# EAGLE design homecomputer-6502 (EAGLE 6.5.0)
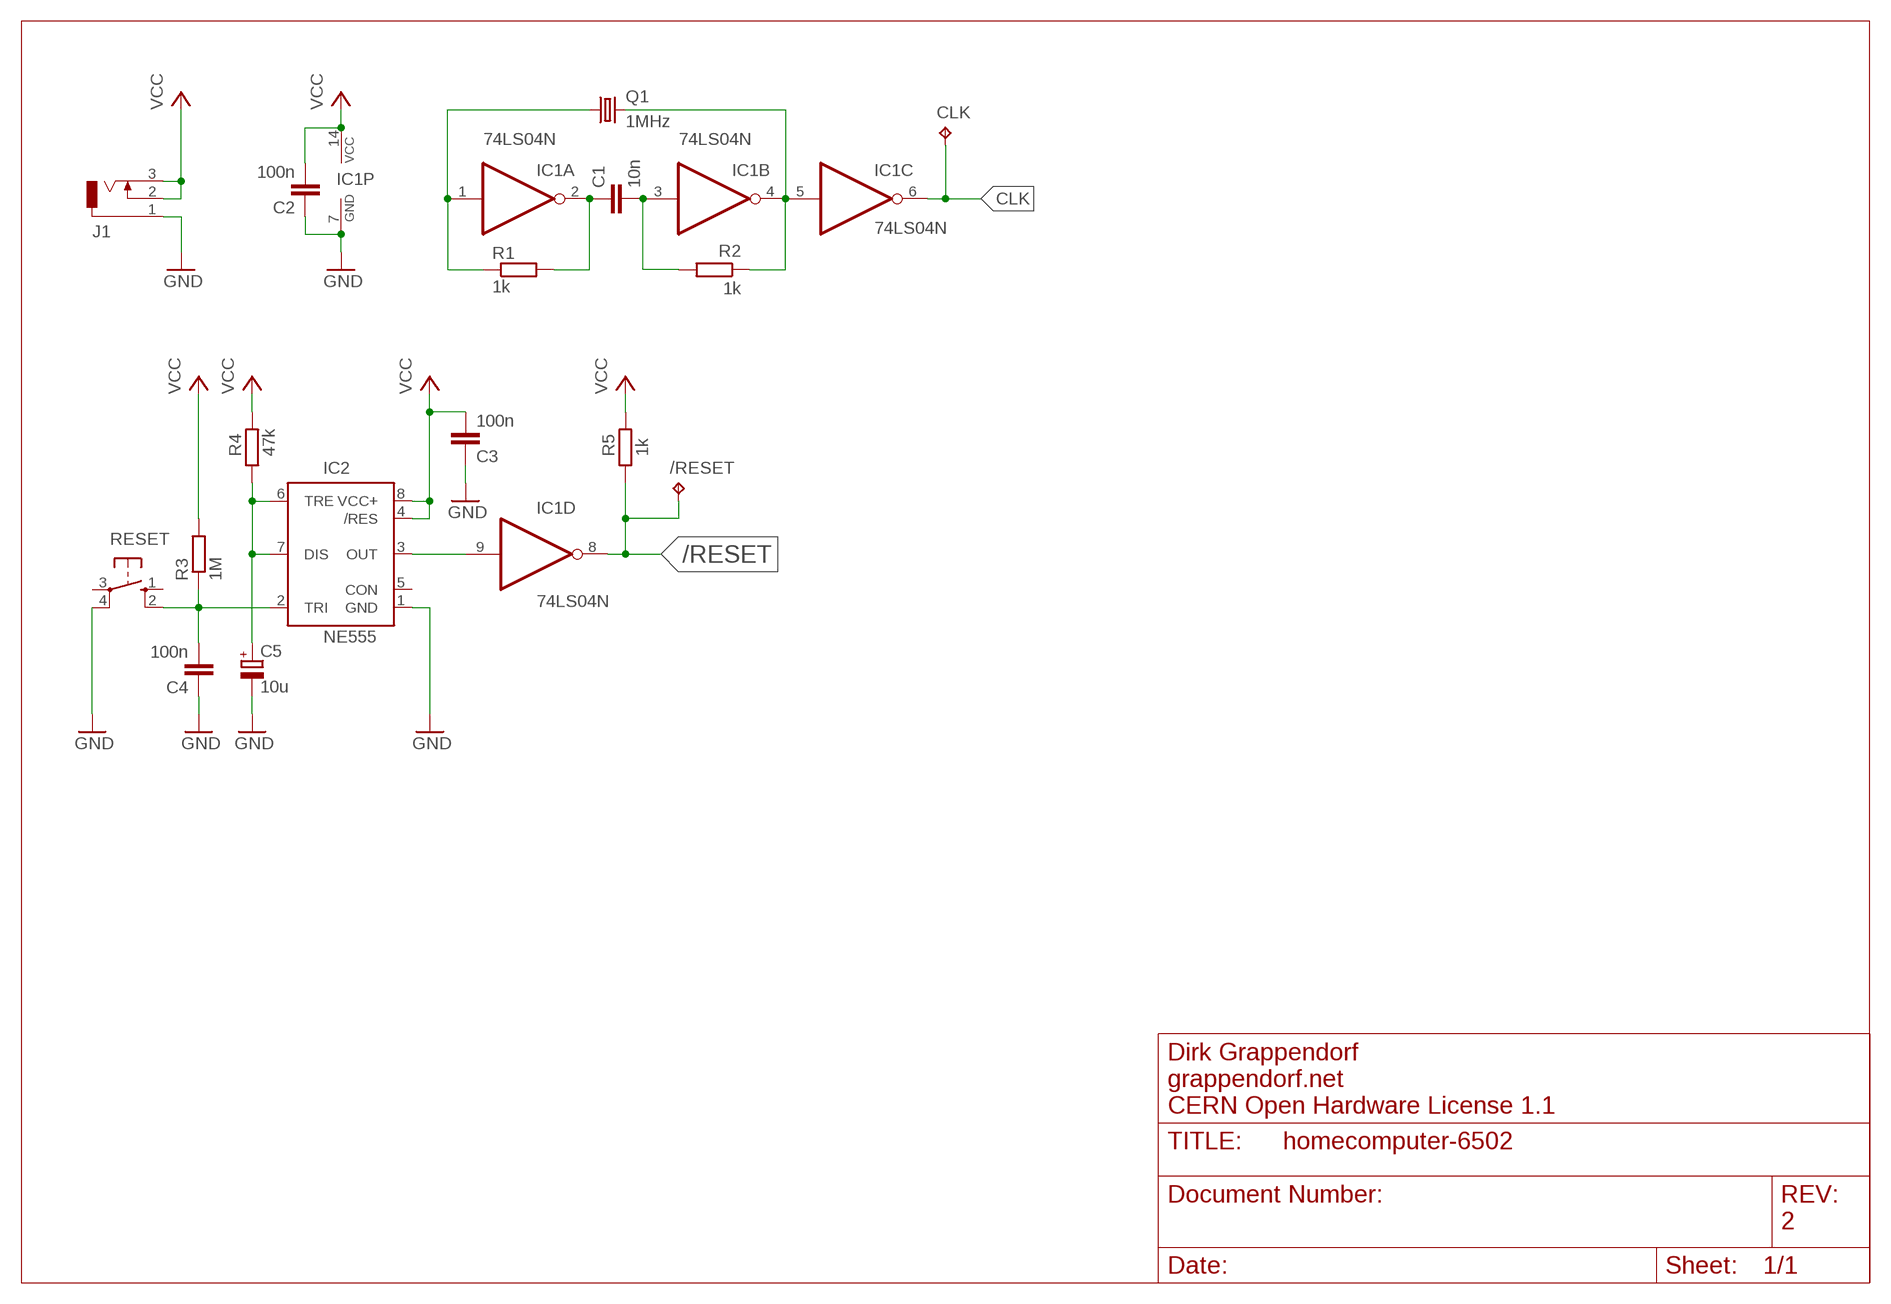
[diagram p0: schematic, sheet 1]

## Parts
/RESET  TPTP15SQ  [TP15SQ]
C1  10n  C-EU025-024X044  [C025-024X044]
C2  100n  C-EU025-024X044  [C025-024X044]
C3  100n  C-EU025-024X044  [C025-024X044]
C4  100n  C-EU025-024X044  [C025-024X044]
C5  10u  CPOL-EUE2,5-6E  [E2,5-6E]
CLK  TPTP15SQ  [TP15SQ]
IC1  74LS04N  [DIL14]
IC2  NE555  [DIL-08]
J1  DCJ0303  [DCJ0303]
Q1  1MHz  CRYSTALHC49U-V  [HC49U-V]
R1  1k  R-EU_0204/5  [0204/5]
R2  1k  R-EU_0204/5  [0204/5]
R3  1M  R-EU_0204/5  [0204/5]
R4  47k  R-EU_0204/5  [0204/5]
R5  1k  R-EU_0204/5  [0204/5]
RESET  10-XX  [B3F-10XX]

## Nets
/RESET: /RESET.TP IC1.8(D:O) R5.1
CLK: CLK.TP IC1.6(C:O)
GND: C2.1 C3.1 C4.1 C5.- IC1.7(P:GND) IC2.1(GND) J1.1 RESET.4(P1)
N$1: IC1.1(A:I) Q1.1 R1.1
N$2: C1.1 IC1.2(A:O) R1.2
N$4: C5.+ IC2.6(TRE) IC2.7(DIS) R4.1
N$5: IC1.9(D:I) IC2.3(OUT)
N$6: C4.2 IC2.2(TRI) R3.1 RESET.2(S1)
N$7: C1.2 IC1.3(B:I) R2.2
N$8: IC1.4(B:O) IC1.5(C:I) Q1.2 R2.1
VCC: C2.2 C3.2 IC1.14(P:VCC) IC2.4(/RES) IC2.8(VCC+) J1.2 J1.3 R3.2 R4.2 R5.2
Unconnected: IC1.10(E:O) IC1.11(E:I) IC1.12(F:O) IC1.13(F:I) IC2.5(CON) RESET.1(S) RESET.3(P)

## Notes on the sheet
- Dirk Grappendorf
- grappendorf.net
- CERN Open Hardware License 1.1
- 2

## Library data of the parts
/RESET CLK = testpad:TP: Test pad
C1-C4 = rcl:C-EU: CAPACITOR, European symbol
C5 = rcl:CPOL-EU: POLARIZED CAPACITOR, European symbol
IC1 = 74xx-eu:74*04: Hex INVERTER
IC2 = st-microelectronics:NE555: General purpose bipolar Timer; MF: Arrow Electronics; MPN: NE555N; OC_FARNELL: 1467742; OC_NEWARK: 89K1486
J1 = con-jack:DCJ0303: DC POWER JACK Source: DCJ0303.pdf; OC_FARNELL: unknown; OC_NEWARK: unknown
Q1 = crystal:CRYSTAL: CRYSTAL; OC_FARNELL: 1666969; OC_NEWARK: unknown
R1-R5 = rcl:R-EU_: RESISTOR, European symbol
RESET = switch-omron:10-XX: OMRON SWITCH; MPN: B3F-1000; OC_FARNELL: 176432; OC_NEWARK: 36M3542

## Board
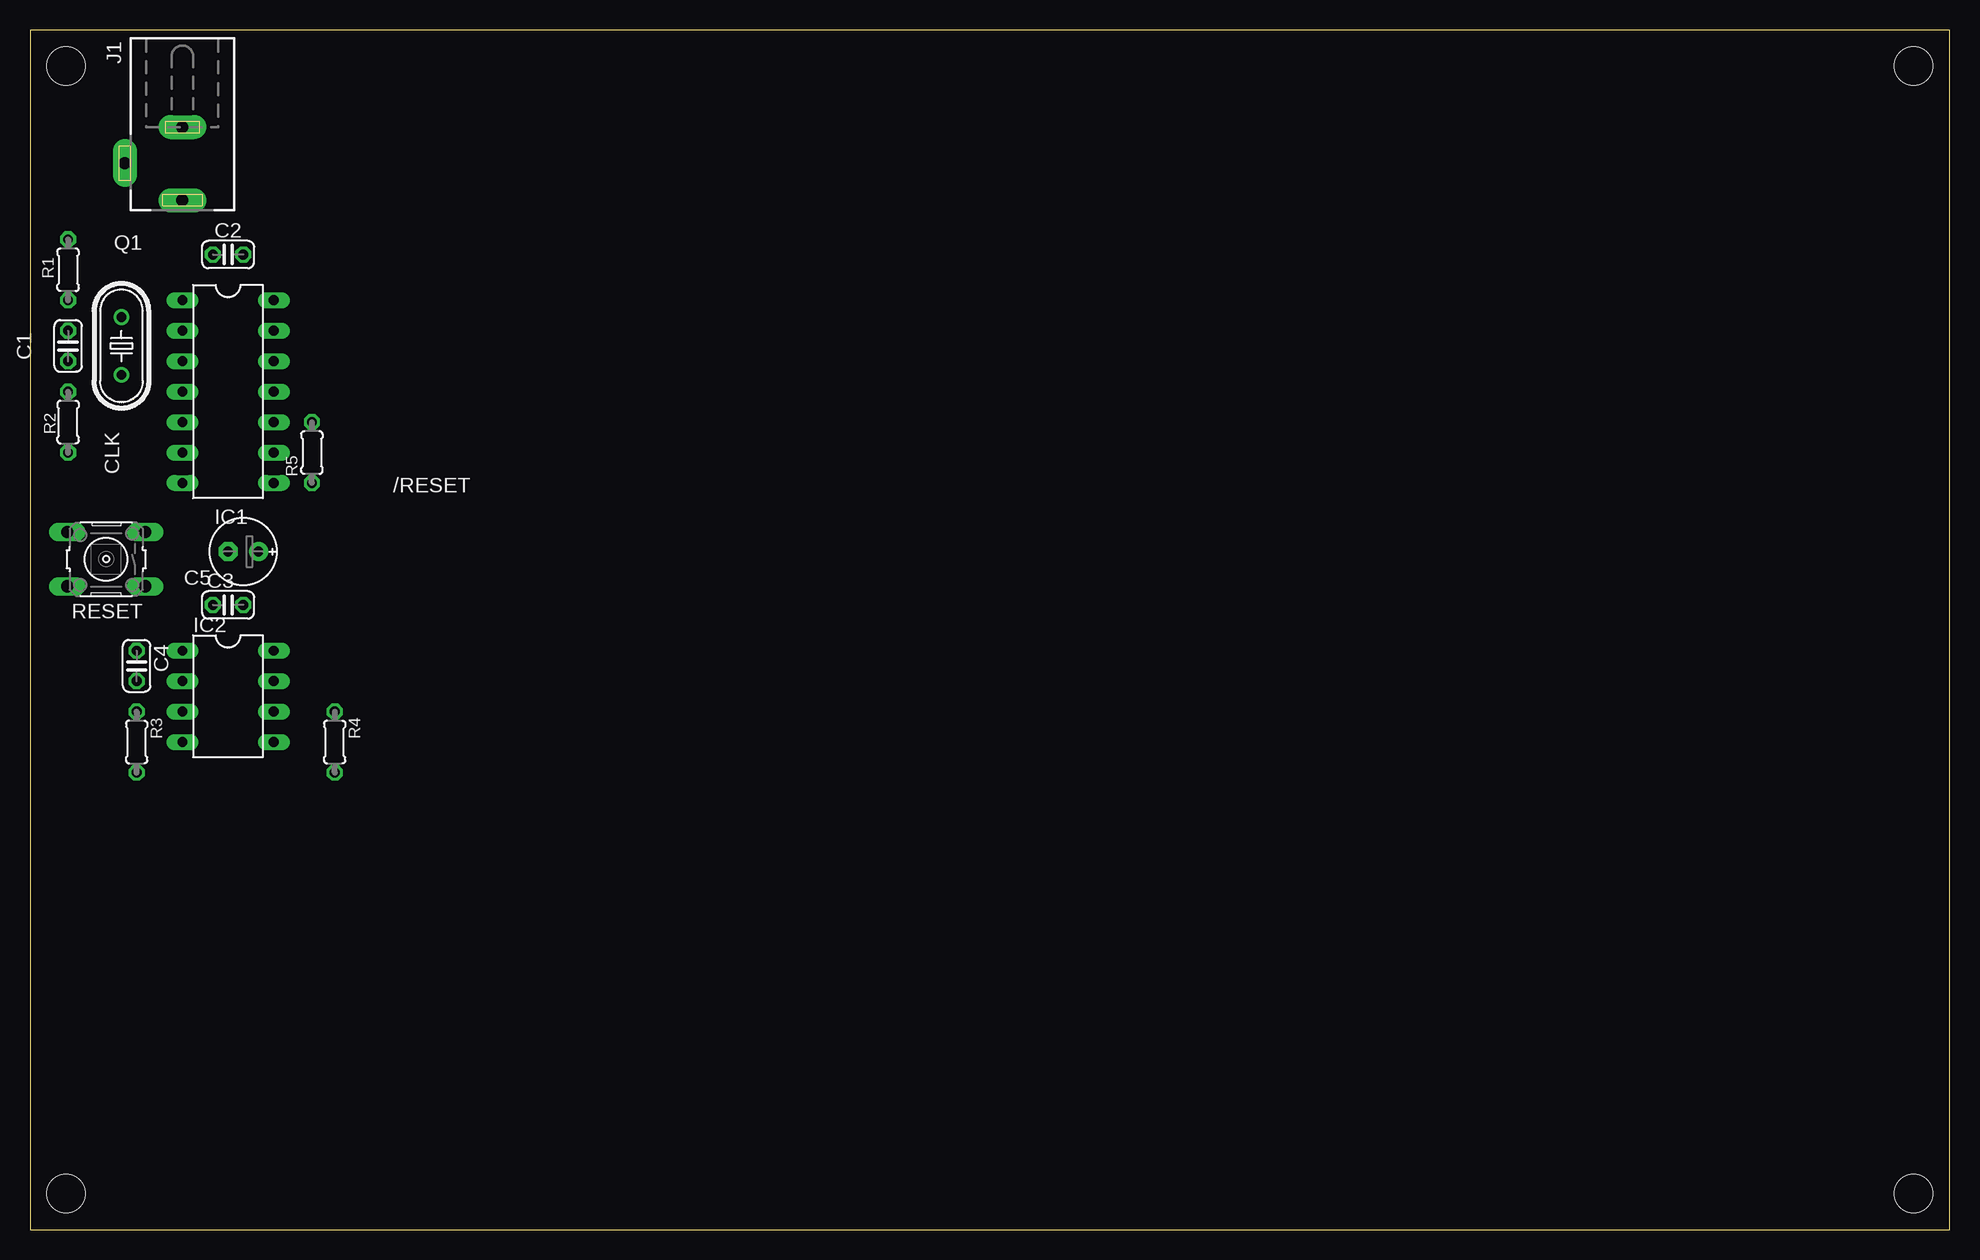
[diagram p1: board, top side]
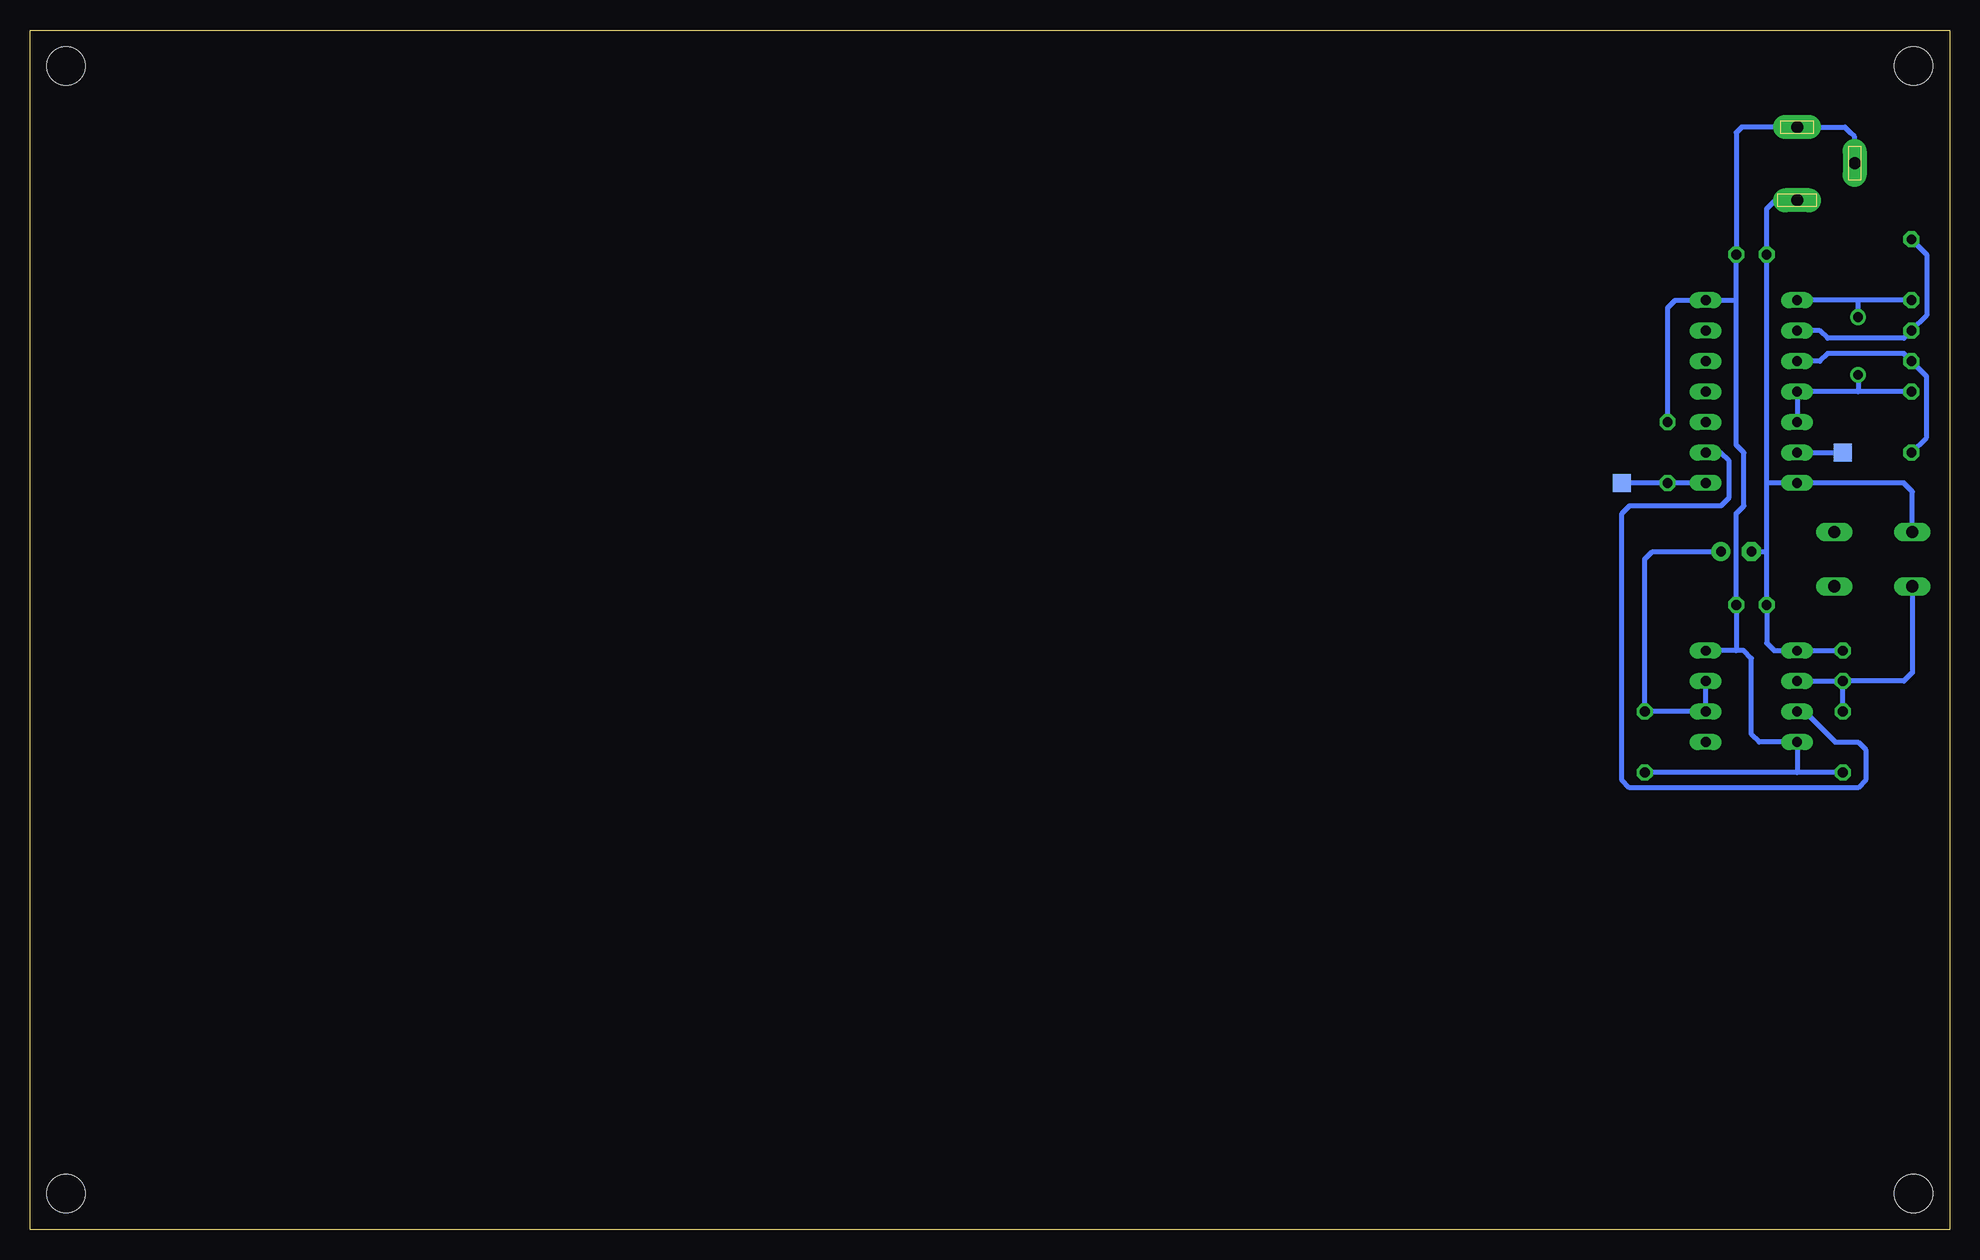
[diagram p2: board, bottom side, seen from below]

Size 160 x 100 mm. Coordinates in mm from the lower left corner, seen from the top.
Outline: 0,0 160,0 160,100 0,100 0,0
Copper layers (1*16): Top 0.035mm / dielectric 1.5mm / Bottom 0.035mm
Design rules "default": minimum track width 10mil, minimum drill 24mil, track to track 8mil, track to pad 8mil, pad to pad 8mil, via to via 8mil, smd to smd 8mil, copper to edge 40mil, drill to drill 8mil, minimum pad ring 10mil, minimum via ring 8mil, stop-mask expansion 4mil, vias tented up to drill 0mil, thermal gap 10mil
Holes 3.2 mm at 3,97 157,97 3,3 157,3

### Footprints (pad centres in the part's own frame; a part is rotated, then mirrored left to right if it is on the bottom)
TP15SQ = smd 1.5 x 1.5: TP 0,0
C025-024X044 = drill 0.813 octagon: 1 -1.27,0; 2 1.27,0
E2,5-6E = drill 0.813 pad 1.575: + -1.27,0 | drill 0.813 pad 1.575 octagon: - 1.27,0
DIL14 = drill 0.813 long: 1 -7.62,-3.81; 2 -5.08,-3.81; 3 -2.54,-3.81; 4 0,-3.81; 5 2.54,-3.81; 6 5.08,-3.81; 7 7.62,-3.81; 8 7.62,3.81; 9 5.08,3.81; 10 2.54,3.81; 11 0,3.81; 12 -2.54,3.81; 13 -5.08,3.81; 14 -7.62,3.81
DIL-08 = drill 0.813 long: 1 -3.81,-3.81; 2 -1.27,-3.81; 3 1.27,-3.81; 4 3.81,-3.81; 5 3.81,3.81; 6 1.27,3.81; 7 -1.27,3.81; 8 -3.81,3.81
DCJ0303 = drill 1 pad 2 long: 1 0,3.1; 2 4.8,0; 3 0,-3
HC49U-V = drill 0.813: 1 -2.413,0; 2 2.413,0
0204/5 = drill 0.813 octagon: 1 -2.54,0; 2 2.54,0
B3F-10XX = drill 1.016 long: 1 -3.251,2.261; 2 3.251,2.261; 3 -3.251,-2.261; 4 3.251,-2.261

### Placement (x,y rotation side)
/RESET  27.3,62.23 180 bottom
C1  3.17,73.66 270 top
C2  16.51,81.28 0 top
C3  16.51,52.07 0 top
C4  8.89,46.99 270 top
C5  17.78,56.52 180 top
CLK  8.89,64.77 0 bottom
IC1  16.51,69.85 270 top
IC2  16.51,44.45 270 top
J1  12.7,88.9 180 top
Q1  7.62,73.66 270 top
R1  3.17,80.01 90 top
R2  3.17,67.31 270 top
R3  8.89,40.64 270 top
R4  25.4,40.64 270 top
R5  23.5,64.77 90 top
RESET  6.35,55.88 180 top

### Tracks (layer width: path | path; a pad name or v marks a point on that pad's centre or on a via)
/RESET
  Bottom 0.406: IC1.8 R5.1 /RESET.TP
CLK
  Bottom 0.406: IC1.6 CLK.TP
GND
  Bottom 0.406: C4.1 IC2.1 14.61,48.26 15.24,48.9 C3.1 15.24,56.52 | 15.24,56.52 15.24,62.23 | 15.24,62.23 C2.1 15.24,85.09 14.61,85.72 12.78,85.72 J1.1 | 15.24,62.23 IC1.7 3.81,62.23 3.1,61.52 RESET.4 | C5.- 15.24,56.52
N$1
  Bottom 0.406: R1.1 7.62,77.47 | 7.62,77.47 IC1.1 | Q1.1 7.62,77.47
N$2
  Bottom 0.406: IC1.2 10.79,74.93 10.16,74.3 3.81,74.3 C1.1 1.91,76.2 1.91,81.28 R1.2
N$4
  Bottom 0.406: IC2.7 IC2.6 R4.1 25.4,55.88 24.77,56.52 C5.+
N$5
  Bottom 0.406: IC2.3 12.06,43.18 9.53,40.64 7.62,40.64 6.99,40.01 6.99,37.47 7.62,36.83 26.67,36.83 27.3,37.47 27.3,59.69 26.67,60.33 19.05,60.33 18.41,60.96 18.41,64.14 19.05,64.77 IC1.9
N$6
  Bottom 0.406: IC2.2 C4.2 | R3.1 C4.2 | RESET.2 3.1,46.43 3.81,45.72 C4.2
N$7
  Bottom 0.406: IC1.3 10.79,72.39 10.16,73.03 3.81,73.03 C1.2 1.91,71.12 1.91,66.04 R2.2
N$8
  Bottom 0.406: IC1.5 IC1.4 7.62,69.85 | R2.1 7.62,69.85 | Q1.2 7.62,69.85
VCC
  Bottom 0.406: J1.2 7.9,91.08 8.26,91.44 8.71,91.9 J1.3 17.32,91.9 17.78,91.44 C2.2 17.78,77.47 | R3.2 12.7,38.1 | 12.7,38.1 R4.2 | 12.7,38.1 IC2.4 15.88,40.64 16.51,41.27 16.51,47.62 17.14,48.26 17.78,48.26 | 17.78,48.26 IC2.8 | 17.78,48.26 C3.2 17.78,59.69 17.14,60.33 17.14,64.77 17.78,65.41 17.78,77.47 | R5.2 23.5,76.83 22.86,77.47 IC1.14 17.78,77.47